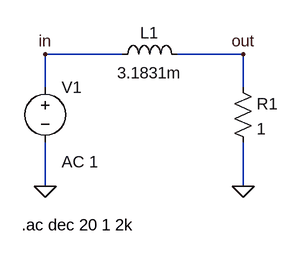
[diagram p0: schematic RL_lowpass Filter.asc]
RL_lowpass Filter.asc, the LTspice schematic file:
Version 4
SHEET 1 880 680
WIRE 160 80 48 80
WIRE 336 80 240 80
WIRE 48 128 48 80
WIRE 336 128 336 80
WIRE 48 272 48 208
WIRE 336 272 336 208
FLAG 48 272 0
FLAG 336 80 out
FLAG 48 80 in
FLAG 336 272 0
SYMBOL voltage 48 112 R0
WINDOW 123 24 124 Left 2
WINDOW 39 0 0 Left 0
SYMATTR InstName V1
SYMATTR Value ""
SYMATTR Value2 AC 1
SYMBOL res 320 112 R0
SYMATTR InstName R1
SYMATTR Value 1
SYMBOL ind 144 96 R270
WINDOW 0 32 56 VTop 2
WINDOW 3 5 56 VBottom 2
SYMATTR InstName L1
SYMATTR Value 3.1831m
TEXT 14 328 Left 2 !.ac dec 20 1 2k

The netlist it stands for:
* RL_lowpass Filter.asc
V1 in 0 AC 1
R1 out 0 1
L1 in out 3.1831m
.ac dec 20 1 2k
.backanno
.end

* Results of the author's LTspice run, read from the files saved beside the schematic
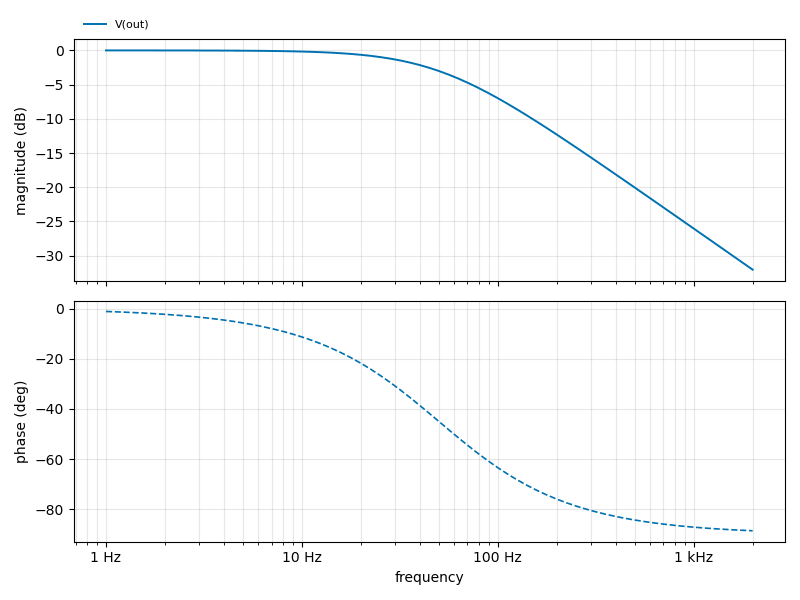
[diagram p1: AC Analysis of RL_lowpass Filter.asc, plotted from the saved traces]
* AC Analysis, 1 run:
*   V(out): -0.01 dB at 1 Hz, -32.04 dB at 2 kHz, peak -0.01 dB at 1 Hz, 3 dB below the peak at 50.07 Hz